# Altium schematic sheet MCU.SchDoc
size A4; Organization: Altium Limited; Address1: L3, 12a Rodborough Rd; Address2: Frenchs Forest; Address3: NSW; Address4: Australia 2086
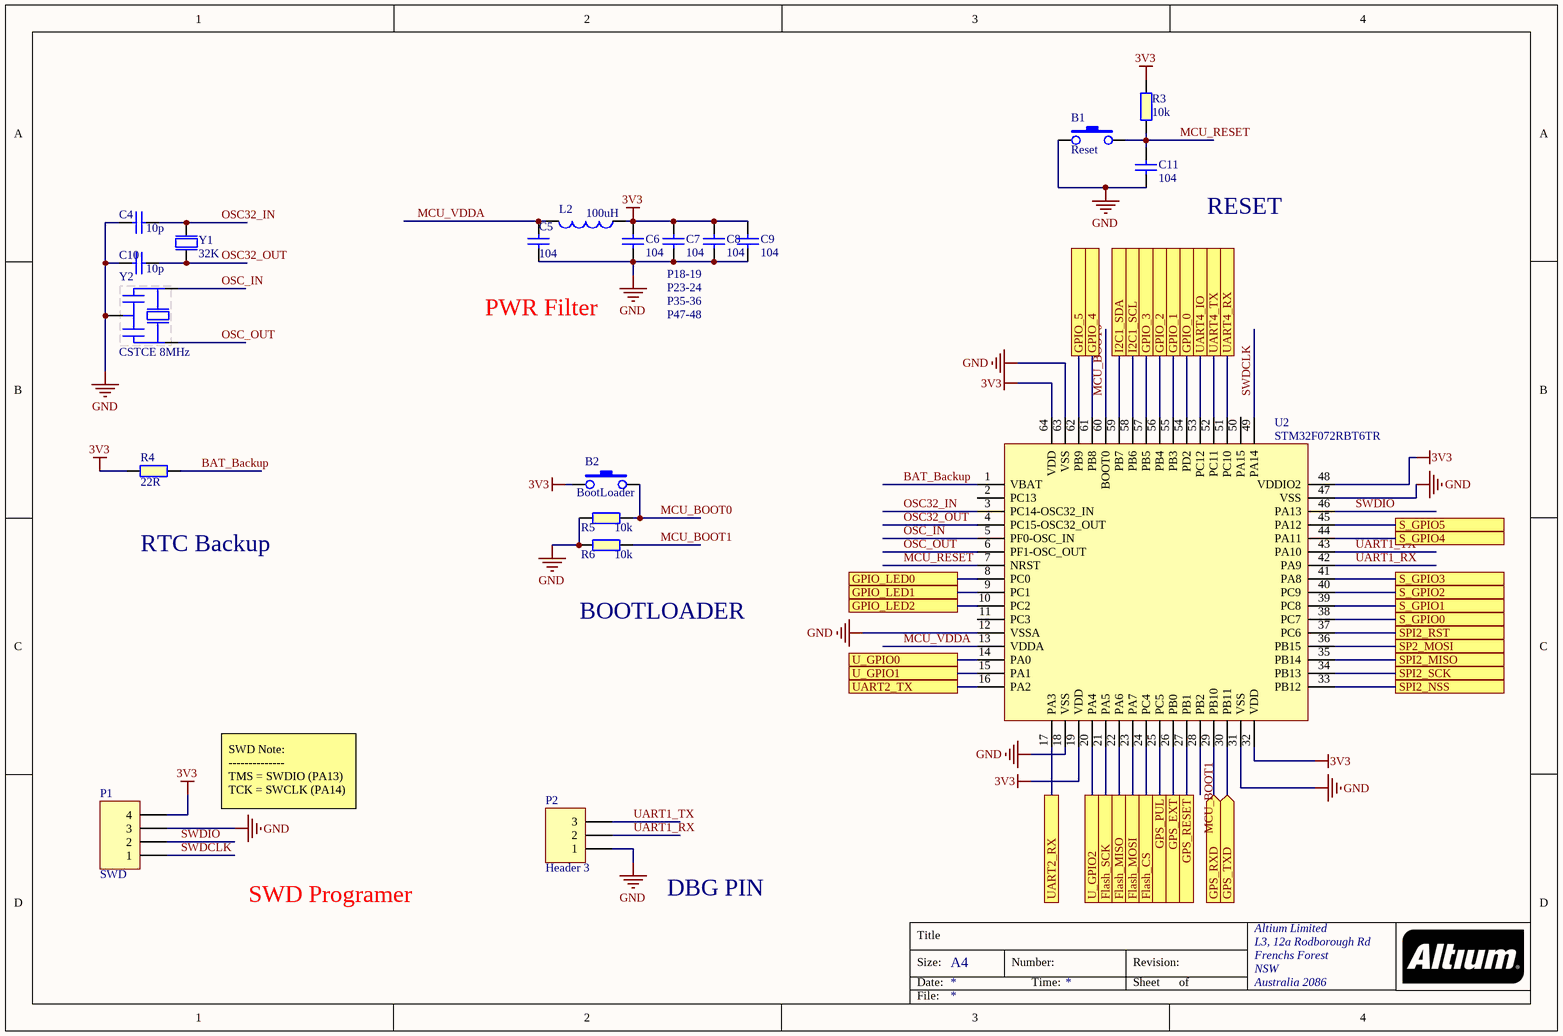
[diagram p0: MCU.SchDoc]

## Parts
B1  Reset  [TACTILE-SWITCH-1101NE]
B2  BootLoader  [TACTILE-SWITCH-1101NE]
C4  10p  [C_0603]
C5  104  [C_0603]
C6  104  [C_0603]
C7  104  [C_0603]
C8  104  [C_0603]
C9  104  [C_0603]
C10  10p  [C_0603]
C11  104  [C_0603]
L2  100uH  [INDUCTOR_0603]
P1  SWD  [HDR1X4]
P2  Header 3  [HDR1X3]
R3  10k  [R_0603]
R4  22R  [R_0603]
R5  10k  [R_0603]
R6  10k  [R_0603]
U2  STM32F072RBT6TR  [STM32L072RBT]
Y1  value 32K  [Crystal_2P]  (hidden comment: Crystal_2P)
Y2  CSTCE 8MHz  [Crystal_4P]

## Ports
Flash_CS, Flash_MISO, Flash_MOSI, Flash_SCK, GPIO_0, GPIO_1, GPIO_2, GPIO_3, GPIO_4, GPIO_5, GPIO_LED0, GPIO_LED1, GPIO_LED2, GPS_EXT, GPS_PUL, GPS_RESET, GPS_RXD (in), GPS_TXD (in), I2C1_SCL, I2C1_SDA, S_GPIO0, S_GPIO1, S_GPIO2, S_GPIO3, S_GPIO4, S_GPIO5, SP2_MOSI, SPI2_MISO, SPI2_NSS, SPI2_RST, SPI2_SCK, U_GPIO0, U_GPIO1, U_GPIO2, UART2_RX, UART2_TX, UART4_IO, UART4_RX, UART4_TX

## Nets
3V3: B2.1 C6.2 C7.2 C8.2 C9.2 L2.1 P1.4 R3.1 R4.1 U2.19(VDD) U2.32(VDD) U2.48(VDDIO2) U2.64(VDD)
GND: B1.1 C4.1 C5.1 C6.1 C7.1 C8.1 C9.1 C10.1 C11.2 P1.3 P2.1 R5.1 R6.1 U2.12(VSSA) U2.18(VSS) U2.31(VSS) U2.47(VSS) U2.63(VSS) Y2.2
BAT_Backup: R4.2 U2.1(VBAT)
Flash_CS: U2.24(PC4) ; port Flash_CS
Flash_MISO: U2.22(PA6) ; port Flash_MISO
Flash_MOSI: U2.23(PA7) ; port Flash_MOSI
Flash_SCK: U2.21(PA5) ; port Flash_SCK
GPIO_0: U2.54(PD2) ; port GPIO_0
GPIO_1: U2.55(PB3) ; port GPIO_1
GPIO_2: U2.56(PB4) ; port GPIO_2
GPIO_3: U2.57(PB5) ; port GPIO_3
GPIO_4: U2.61(PB8) ; port GPIO_4
GPIO_5: U2.62(PB9) ; port GPIO_5
GPIO_LED0: U2.8(PC0) ; port GPIO_LED0
GPIO_LED1: U2.9(PC1) ; port GPIO_LED1
GPIO_LED2: U2.10(PC2) ; port GPIO_LED2
GPS_EXT: U2.26(PB0) ; port GPS_EXT
GPS_PUL: U2.25(PC5) ; port GPS_PUL
GPS_RESET: U2.27(PB1) ; port GPS_RESET
GPS_RXD: U2.29(PB10) ; port GPS_RXD
GPS_TXD: U2.30(PB11) ; port GPS_TXD
I2C1_SCL: U2.58(PB6) ; port I2C1_SCL
I2C1_SDA: U2.59(PB7) ; port I2C1_SDA
MCU_BOOT0: B2.2 R5.2 U2.60(BOOT0)
MCU_BOOT1: R6.2 U2.28(PB2)
MCU_RESET: B1.2 C11.1 R3.2 U2.7(NRST)
MCU_VDDA: C5.2 L2.2 U2.13(VDDA)
OSC32_IN: C4.2 U2.3(PC14-OSC32_IN) Y1.2
OSC32_OUT: C10.2 U2.4(PC15-OSC32_OUT) Y1.1
OSC_IN: U2.5(PF0-OSC_IN) Y2.1
OSC_OUT: U2.6(PF1-OSC_OUT) Y2.3
S_GPIO0: U2.38(PC7) ; port S_GPIO0
S_GPIO1: U2.39(PC8) ; port S_GPIO1
S_GPIO2: U2.40(PC9) ; port S_GPIO2
S_GPIO3: U2.41(PA8) ; port S_GPIO3
S_GPIO4: U2.44(PA11) ; port S_GPIO4
S_GPIO5: U2.45(PA12) ; port S_GPIO5
SP2_MOSI: U2.36(PB15) ; port SP2_MOSI
SPI2_MISO: U2.35(PB14) ; port SPI2_MISO
SPI2_NSS: U2.33(PB12) ; port SPI2_NSS
SPI2_RST: U2.37(PC6) ; port SPI2_RST
SPI2_SCK: U2.34(PB13) ; port SPI2_SCK
SWDCLK: P1.1 U2.49(PA14)
SWDIO: P1.2 U2.46(PA13)
U_GPIO0: U2.14(PA0) ; port U_GPIO0
U_GPIO1: U2.15(PA1) ; port U_GPIO1
U_GPIO2: U2.20(PA4) ; port U_GPIO2
UART1_RX: P2.2 U2.42(PA9)
UART1_TX: P2.3 U2.43(PA10)
UART2_RX: U2.17(PA3) ; port UART2_RX
UART2_TX: U2.16(PA2) ; port UART2_TX
UART4_IO: U2.53(PC12) ; port UART4_IO
UART4_RX: U2.51(PC10) ; port UART4_RX
UART4_TX: U2.52(PC11) ; port UART4_TX

Not connected (* = marked no-connect by the designer): U2 2(PC13) 11(PC3) 50(PA15)

## Notes on the sheet
- RESET
- P23-24
- P35-36
- P18-19
- PWR Filter
- P47-48
- RTC Backup
- BOOTLOADER
- SWD Note:
  --------------
  TMS = SWDIO (PA13)
  TCK = SWCLK (PA14)
- SWD Programer
- DBG PIN
- Title
- Size:
- Date:
- A4
- Number:
- Time:
- Revision:
- Sheet
- of
- File:

## Library data of the parts
B1 B2 = Button_2P_SMD
C4-C11 = Cap SMD 0805: Capacitor SMD; Published: 8-Jun-2000; LatestRevisionDate: 17-Jul-2002; LatestRevisionNote: Re-released for DXP Platform.; PackageReference: RAD-0.3; Publisher: Altium Limited
  C4 C10: Value: 10p
  C5-C9 C11: Value: 104
L2 = INDUCTOR_0805
P1 = Header 4: Header, 4-Pin; LatestRevisionDate: 17-Jul-2002; LatestRevisionNote: Re-released for DXP Platform.; Publisher: Altium Limited
P2 = Header 3: Header, 3-Pin; LatestRevisionDate: 17-Jul-2002; LatestRevisionNote: Re-released for DXP Platform.; Publisher: Altium Limited
R3-R6 = RESISTOR_0805
  R3 R5 R6: Value: 10k
  R4: Value: 22R
U2 = STM32F072RBT6TR: IC MCU 32BIT 128KB FLASH 64LQFP; Manufacturer: STMicroelectronics; Min Supply Voltage: 2V; Max Supply Voltage: 3.6V; RAM Size: 16KB; Number of I/Os: 51; Frequency: 48MHz; Max Power Dissipation: 455mW; Interface: I2C,SPI,USB,CAN,HDMI,IrDA,UART,USART,LIN,I2S; Number of Timers/Counters: 9; Oscillator Type: Internal; Data Bus Width: 32b; Watchdog Timer: Yes; Number of ADC Channels: 19; Peripherals: POR,PWM,WDT,DMA; Core Architecture: ARM; Manufacturer Part Number: STM32F072RBT6; Stock 1: 9149; Pricing 1: 1=3.93, 10=3.532, 160=2.89381, 640=2.46344, 1120=2.0776 (USD); Mount: Surface Mount; Case/Package: LQFP; Number of Pins: 64; Weight: 0.012088oz; Min Operating Temperature: -40°C; Max Operating Temperature: 85°C; Memory Size: 128KB; Packaging: Tray; Number of Programmable I/O: 51; Max Frequency: 48MHz; Memory Type: FLASH; Package Quantity: 960; REACH SVHC: No SVHC; Lead Free: Lead Free; ComponentLink1URL: http://www.st.com/web/en/resource/technical/document/datasheet/DM00090510.pdf?src-supplier=Avnet; ComponentLink1Description: http://www.st.com/web/en/resource/technical/document/datasheet/DM00090510.pdf?src-supplier=Avnet; Supplier 1: Digi-Key; Supplier Part Number 1: 497-14644-ND
Y2 = Crystal_CSTCE: (T) Crystal MHz with Capacitance Built-in